# EasyEDA Pro project DPOV1.epro, board PCB2
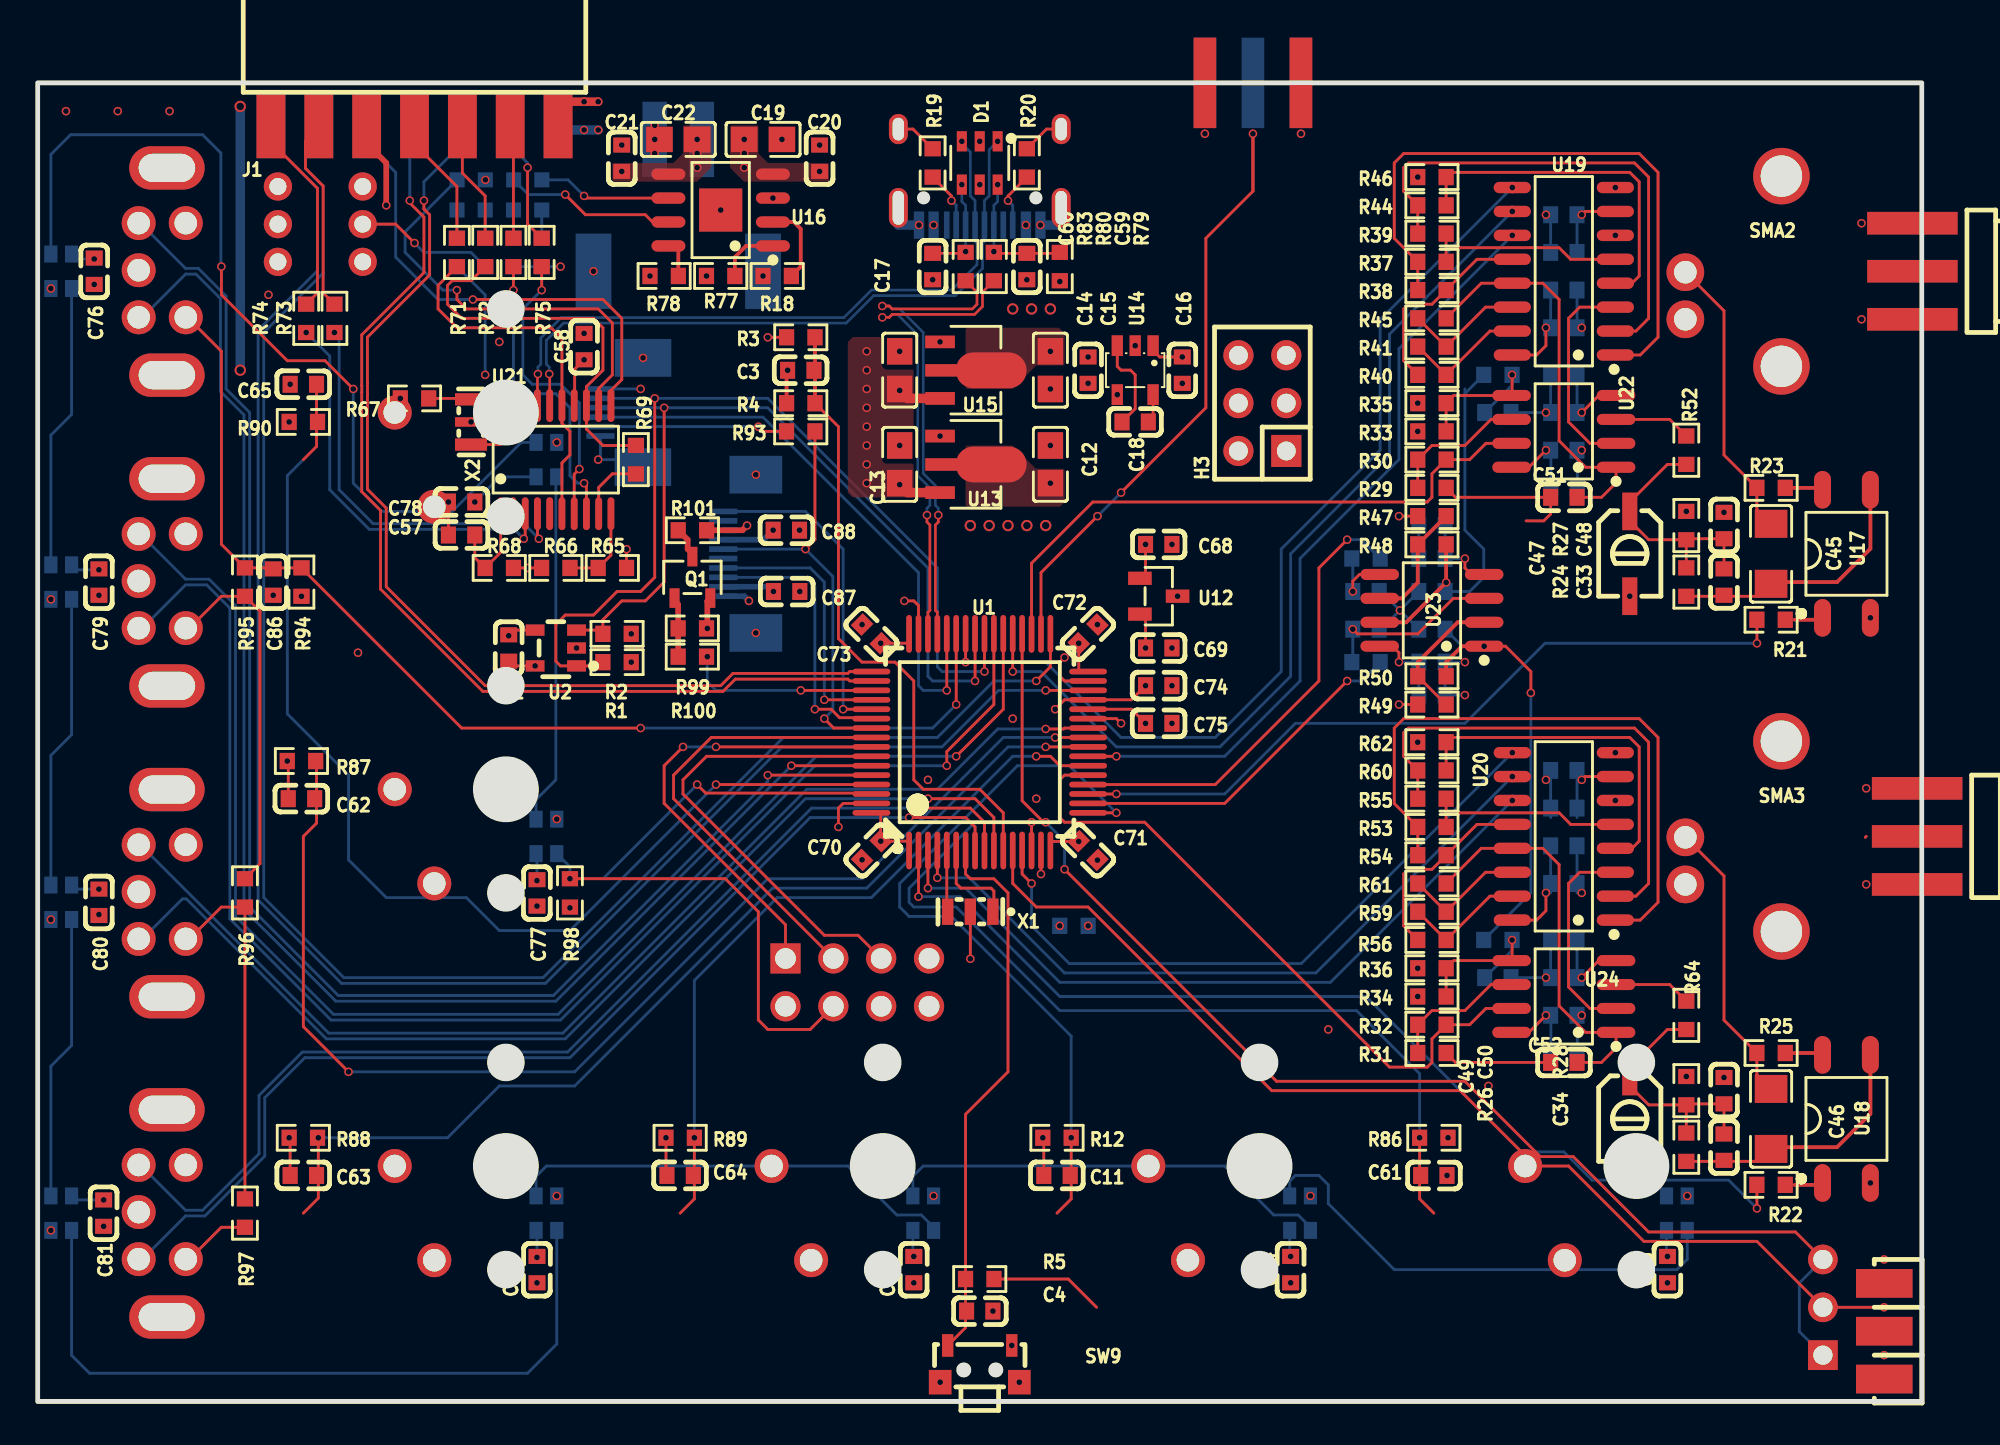
[diagram p4: board, top side]
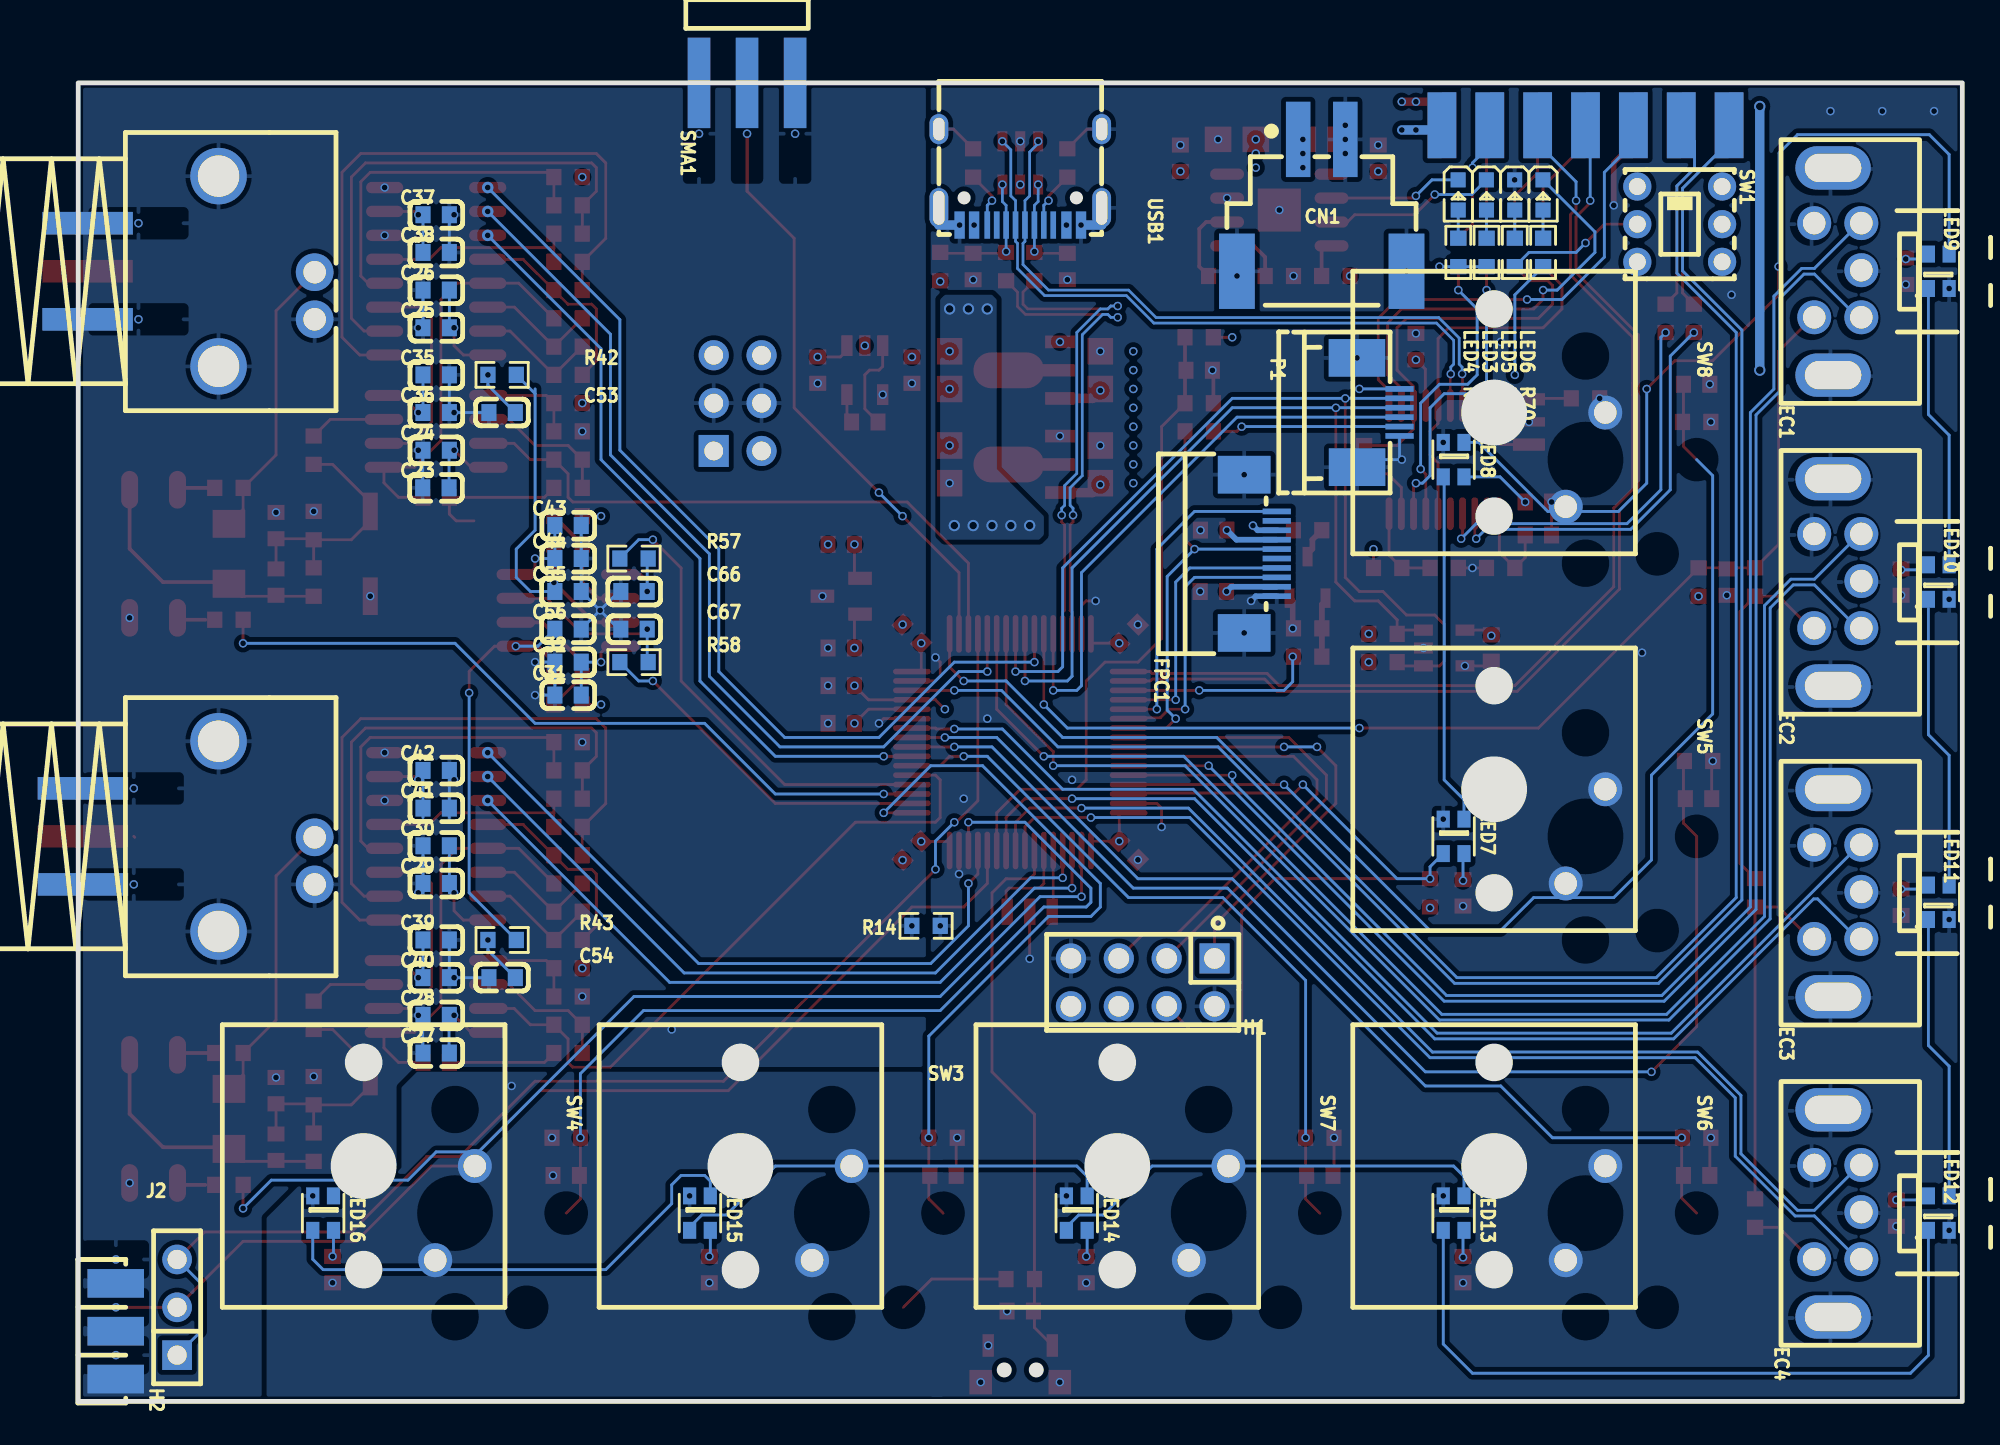
[diagram p5: board, bottom side, seen from below]

Outline 100 x 70 mm; copper layers: Top Layer, Inner1, 内层2, Bottom Layer. Coordinates in mm from the lower left corner of the outline.
Outline path: rectangle 100,0 0,70
Stack: Top Layer 0.035mm 外层铜厚1oz / Dielectric1 0.2104mm 7628 RC49% 8.6mil / Inner1 0.0152mm 内层铜厚 / Dielectric2 1.065mm 1.1mm H/HOZ Copper / 内层2 0.0152mm 内层铜厚 / Dielectric3 0.2104mm 7628 RC49% 8.6mil / Bottom Layer 0.035mm 外层铜厚1oz

## Design rules (mm)
net USB32P_P: DP2
net USB32P_N: DP2
net USB305_P: DP1
net USB305_N: DP1
net PA12: DP3
net PA11: DP3
net PA13: DP10
net PA14: DP10
net TX305: DP8
net PB10: DP9
net RX305: DP8
net PB11: DP9
net ENC4_1: DP5
net ENC4_2: DP5
net ENC3_1: DP4
net ENC3_2: DP4
net ENC20_2: DP6
net ENC20_1: DP6
net ENC1_2: DP7
net ENC1_1: DP7
template: 自定义配置
spacing copperThickness1oz (default): track to track 0.102, other pairs 0.152 to 0.3
spacing copperThickness2oz: track to track 0.203, other pairs 0.152 to 0.3
track width copperThickness1oz (default): min 0.127, default 0.15, max 2.54
track width copperThickness2oz: min 0.203, default 0.254, max 2.54
differential pair differentialPair (default): width min 0.1, default 0.15, max 0.2; gap min 0.152, default 0.152
differential pair 90ou: width min 0.127, default 0.141, max 0.254; gap min 0.15, default 0.15
via viaSize (default): diameter min 0.45, default 0.45, max 10; hole min 0.3, default 0.305, max 6.299
net VDD uses innerPlane2, 全连接
net VCC uses innerPlane2, 全连接
net VDDA uses 全连接
net VUSB uses innerPlane2, 全连接
net VBAT uses innerPlane2, 全连接
net USB32P_P uses 90ou
net USB32P_N uses 90ou
net USB305_P uses 90ou
net USB305_N uses 90ou
net PA12 uses 90ou
net PA11 uses 90ou
diff pair DP2 uses 90ou
diff pair DP1 uses 90ou
diff pair DP3 uses 90ou

## Placement (name value [footprint] x y rotation side)
C1  104  [C0603]  25 40 90 top
C3  104  [C0603]  40.5 54.74 0 top
C4  104  [C0603]  50 4.8 180 top
C11  104  [C0603]  54.1 12 0 top
C12  106  [C0805]  53.75 49.75 270 top
C13  106  [C0805]  45.75 49.75 90 top
C14  106  [C0805]  53.75 54.75 90 top
C15  105  [C0603]  55.75 54.75 90 top
C16  105  [C0603]  60.75 54.75 90 top
C17  106  [C0805]  45.75 54.75 90 top
C18  105  [C0603]  58.25 52 0 top
C19  10uF  [C0805]  38.5 67 180 top
C20  1uF  [C0603]  41.5 66 270 top
C21  1uF  [C0603]  31 66 270 top
C22  10uF  [C0805]  34 67 0 top
C23  104  [C0603]  81.02 48.51 0 bottom
C24  106  [C0603]  81 50.5 0 bottom
C25  104  [C0603]  81 57 0 bottom
C26  106  [C0603]  81 59 0 bottom
C27  104  [C0603]  81 18.5 0 bottom
C28  106  [C0603]  81 20.5 0 bottom
C29  104  [C0603]  81 27.5 0 bottom
C30  106  [C0603]  81 29.5 0 bottom
C31  104  [C0603]  74 37.5 0 bottom
C32  106  [C0603]  74 39.25 0 bottom
C33  100pF  [C0603]  89.5 43.5 270 top
C34  100pF  [C0603]  89.5 13.5 270 top
C35  104  [C0603]  81 54.5 0 bottom
C36  106  [C0603]  81 52.5 0 bottom
C37  104  [C0603]  81 63 0 bottom
C38  106  [C0603]  81 61 0 bottom
C39  104  [C0603]  81 24.5 0 bottom
C40  106  [C0603]  81 22.5 0 bottom
C41  104  [C0603]  81 31.5 0 bottom
C42  106  [C0603]  81 33.5 0 bottom
C43  104  [C0603]  74 46.5 0 bottom
C44  106  [C0603]  74 44.75 0 bottom
C45  100nF  [C1206]  92 45 270 top
C46  100nF  [C1206]  92 15 270 top
C47  30pF  [CAP-ADJ-SMD_L4.5-W3.2-L]  84.5 45 270 top
C48  300pF  [C0603]  89.5 46.5 270 top
C49  30pF  [CAP-ADJ-SMD_L4.5-W3.2-L]  84.5 15 270 top
C50  300pF  [C0603]  89.5 16.5 270 top
C51  104  [C0603]  81 48 180 top
C52  104  [C0603]  81 18 180 top
C53  104  [C0603]  77.5 52.5 180 bottom
C54  104  [C0603]  77.5 22.5 180 bottom
C55  104  [C0603]  74 43 180 bottom
C56  104  [C0603]  74 41 180 bottom
C57  100nF  [C0603]  22.5 46 0 top
C58  100nF  [C0603]  29 56 90 top
C59  22p  [C0603]  52.5 60.25 90 top
C60  22p  [C0603]  47.5 60.25 90 top
C61  104  [C0603]  74.1 12 180 top
C62  104  [C0603]  14 32 0 top
C63  104  [C0603]  14.1 12 0 top
C64  104  [C0603]  34.1 12 0 top
C65  104  [C0603]  14.1 54 0 top
C66  104  [C0603]  70.5 43 0 bottom
C67  104  [C0603]  70.5 41 0 bottom
C68  104  [C0603]  59.5 45.5 180 top
C69  104  [C0603]  59.5 40 0 top
C70  104  [C0603]  44.25 29.25 225 top
C71  104  [C0603]  55.75 29.25 315 top
C72  104  [C0603]  55.75 40.75 45 top
C73  104  [C0603]  44.25 40.75 135 top
C74  104  [C0603]  59.5 38 0 top
C75  104  [C0603]  59.5 36 0 top
C76  104  [C0603]  3 60 90 top
C77  104  [C0603]  26.5 27 90 top
C78  104  [C0603]  22.5 47.75 0 top
C79  104  [C0603]  3.25 43.5 90 top
C80  104  [C0603]  3.25 26.5 90 top
C81  104  [C0603]  3.5 10 90 top
C82  104  [C0603]  26.5 7 90 top
C83  104  [C0603]  46.5 7 90 top
C84  104  [C0603]  66.5 7 90 top
C85  104  [C0603]  86.5 7 90 top
C86  104  [C0603]  12.5 43.5 90 top
C87  104  [C0603]  39.75 43 180 top
C88  104  [C0603]  39.73 46.26 180 top
CN1  XH2.54-2P  [CONN-SMD_2P-P2.50-WT]  34 63.5 180 bottom
D1  SRV05-4  [SOT-23-6_L2.9-W1.6-P0.95-LS2.8-BL]  50 65.75 180 top
EC1  -  [ec11卧式立式编码器]  5.5 60 90 bottom
EC2  -  [ec11卧式立式编码器]  5.5 43.5 90 bottom
EC3  -  [ec11卧式立式编码器]  5.5 27 90 bottom
EC4  -  [ec11卧式立式编码器]  5.5 10 90 bottom
FPC1  AFC07-S10FCC-00  [FPC-SMD_P0.5-10P_LSXJ-H2.0-10P]  37.25 45 90 bottom
H1  -  [HDR-TH_8P-P2.54-V-F-R2-C4-S2.54-1]  43.5 22.25 0 bottom
H2  -  [HDR-TH_3P-P2.54-V-F]  94.75 5 90 bottom
H3  -  [HDR-TH_6P-P2.54-V-F-R2-C3-S2.54]  65 53 90 top
J1  2.54-2*7P母  [排母_2X7P_2.54_双层]  20 69.5 0 top
J2  -  [侧插排针_3Px2_2.54]  98 5 0 bottom
LED3  -  [LED_0603]  25.25 64 270 bottom
LED4  -  [LED_0603]  26.75 64 270 bottom
LED5  -  [LED_0603]  23.75 64 270 bottom
LED6  -  [LED_0603]  22.25 64 270 bottom
LED7  WS2812C-2020-V1  [LED-SMD_4P-L2.0-W2.0-TL_WS2812B-2020]  27 30 270 bottom
LED8  WS2812C-2020-V1  [LED-SMD_4P-L2.0-W2.0-TL_WS2812B-2020]  27 50 270 bottom
LED9  WS2812C-2020-V1  [LED-SMD_4P-L2.0-W2.0-TL_WS2812B-2020]  1.25 60 90 bottom
LED10  WS2812C-2020-V1  [LED-SMD_4P-L2.0-W2.0-TL_WS2812B-2020]  1.25 43.5 90 bottom
LED11  WS2812C-2020-V1  [LED-SMD_4P-L2.0-W2.0-TL_WS2812B-2020]  1.25 26.5 90 bottom
LED12  WS2812C-2020-V1  [LED-SMD_4P-L2.0-W2.0-TL_WS2812B-2020]  1.25 10 90 bottom
LED13  WS2812C-2020-V1  [LED-SMD_4P-L2.0-W2.0-TL_WS2812B-2020]  27 10 270 bottom
LED14  WS2812C-2020-V1  [LED-SMD_4P-L2.0-W2.0-TL_WS2812B-2020]  47 10 270 bottom
LED15  WS2812C-2020-V1  [LED-SMD_4P-L2.0-W2.0-TL_WS2812B-2020]  67 10 270 bottom
LED16  WS2812C-2020-V1  [LED-SMD_4P-L2.0-W2.0-TL_WS2812B-2020]  87 10 270 bottom
P1  AFC07-S06ECC-00  [FPC-SMD_AFC07-S06ECC-00]  31 52.5 270 bottom
Q1  SI2301CDS-T1-GE3_JC  [SOT-23-3_L3.0-W1.7-P0.95-LS2.9-BR]  34.75 43.75 270 top
R1  10K  [R0603]  30.75 39.25 0 top
R2  10K  [R0603]  30.75 40.75 0 top
R3  10K  [R0603]  40.5 56.49 180 top
R4  10K  [R0603]  40.5 52.99 0 top
R5  10K  [R0603]  50 6.5 0 top
R12  10K  [R0603]  54.1 14 0 top
R14  0  [R0603]  55 25.25 180 bottom
R17  10K  [R0603]  25.25 61 270 bottom
R18  1K  [R0603]  39.25 59.75 0 top
R19  5.1K  [R0603]  47.5 65.75 90 top
R20  5.1K  [R0603]  52.5 65.75 90 top
R21  1kΩ  [R0603]  92 41.5 180 top
R22  1kΩ  [R0603]  92 11.5 180 top
R23  50Ω  [R0603]  92 48.5 0 top
R24  820kΩ  [R0603]  87.5 43.5 270 top
R25  50Ω  [R0603]  92 18.5 0 top
R26  820kΩ  [R0603]  87.5 13.5 270 top
R27  205kΩ  [R0603]  87.5 46.5 270 top
R28  205kΩ  [R0603]  87.5 16.5 270 top
R29  10K  [R0603]  74 48.5 0 top
R30  10K  [R0603]  74 50 180 top
R31  10K  [R0603]  74 18.5 0 top
R32  10K  [R0603]  74 20 180 top
R33  30K(optional)  [R0603]  74 51.5 180 top
R34  30K(optional)  [R0603]  74 21.5 180 top
R35  10K(optional)  [R0603]  74 53 0 top
R36  10K(optional)  [R0603]  74 23 0 top
R37  200Ω  [R0603]  74 60.5 180 top
R38  402Ω  [R0603]  74 59 0 top
R39  100Ω  [R0603]  74 62 180 top
R40  806Ω  [R0603]  74 54.5 180 top
R41  1.62kΩ  [R0603]  74 56 180 top
R42  10K(optional)  [R0603]  77.5 54.5 0 bottom
R43  10K(optional)  [R0603]  77.5 24.5 0 bottom
R44  49.9Ω  [R0603]  74 63.5 0 top
R45  3.24kΩ  [R0603]  74 57.5 0 top
R46  49.9Ω  [R0603]  74 65 0 top
R47  500  [R0603]  74 47 180 top
R48  500  [R0603]  74 45.5 180 top
R49  500  [R0603]  74 37 180 top
R50  500  [R0603]  74 38.5 180 top
R52  1K  [R0603]  87.5 50.5 90 top
R53  200Ω  [R0603]  74 30.5 180 top
R54  402Ω  [R0603]  74 29 0 top
R55  100Ω  [R0603]  74 32 180 top
R56  806Ω  [R0603]  74 24.5 180 top
R57  1K  [R0603]  70.5 44.75 180 bottom
R58  1K  [R0603]  70.5 39.25 180 bottom
R59  1.62kΩ  [R0603]  74 26 180 top
R60  49.9Ω  [R0603]  74 33.5 0 top
R61  3.24kΩ  [R0603]  74 27.5 0 top
R62  49.9Ω  [R0603]  74 35 0 top
R64  1K  [R0603]  87.5 20.5 90 top
R65  10kΩ  [R0603]  30.5 44.25 0 top
R66  0Ω(NC)  [R0603]  27.5 44.25 0 top
R67  0Ω(NC)  [R0603]  20 53.25 0 top
R68  0Ω(NC)  [R0603]  24.5 44.25 180 top
R69  1kΩ  [R0603]  31.75 50 270 top
R70  10kΩ  [R0603]  22.25 61 90 bottom
R71  100Ω  [R0603]  22.25 61 90 top
R72  100Ω  [R0603]  23.75 61 90 top
R73  270Ω  [R0603]  15.75 57.5 90 top
R74  270Ω  [R0603]  14.25 57.5 90 top
R75  100Ω  [R0603]  26.75 61 90 top
R76  100Ω  [R0603]  25.25 61 90 top
R77  NC  [R0603]  36.25 59.75 0 top
R78  NC  [R0603]  33.25 59.75 180 top
R79  5.1K  [R0603]  54.25 60.25 90 top
R80  33R  [R0603]  50.75 60.25 270 top
R83  33R  [R0603]  49.25 60.25 270 top
R86  10K  [R0603]  74.1 14 180 top
R87  10K  [R0603]  14 34 0 top
R88  10K  [R0603]  14.1 14 0 top
R89  10K  [R0603]  34.1 14 0 top
R90  10K  [R0603]  14.1 52 0 top
R91  10K  [R0603]  23.75 61 90 bottom
R92  10K  [R0603]  26.75 61 270 bottom
R93  0  [R0603]  40.5 51.5 0 top
R94  10K  [R0603]  14 43.5 270 top
R95  10K  [R0603]  11 43.5 90 top
R96  10K  [R0603]  11 27 90 top
R97  10K  [R0603]  11 10 90 top
R98  10K  [R0603]  28.25 27 90 top
R99  10K  [R0603]  34.75 41.04 180 top
R100  10  [R0603]  34.75 39.54 0 top
R101  10  [R0603]  34.75 46.25 180 top
RF1  DOSIN-801-0031  [BNC-TH_DOSIN-801-0030]  90 60 90 bottom
RF2  DOSIN-801-0031  [BNC-TH_DOSIN-801-0030]  90 30 90 bottom
SMA1  SMA  [SMA-SMD_BWSMA-KE-P001]  64.5 70 90 bottom
SMA2  SMA  [SMA-SMD_BWSMA-KE-P001]  99.5 60 0 top
SMA3  SMA  [SMA-SMD_BWSMA-KE-P001]  99.75 30 0 top
SW1  PS-5850DVB-6PL  [SW-TH_6P-L5.8-W5.8-P2.00-LS4.5-BL_1]  15 62.5 270 bottom
SW3  CPG135001D02  [KEY-TH_CPG135001D0X]  60 10 270 bottom
SW4  CPG135001D02  [KEY-TH_CPG135001D0X]  80 10 270 bottom
SW5  CPG135001D02  [KEY-TH_CPG135001D0X]  20 30 270 bottom
SW6  CPG135001D02  [KEY-TH_CPG135001D0X]  20 10 270 bottom
SW7  CPG135001D02  [KEY-TH_CPG135001D0X]  40 10 270 bottom
SW8  CPG135001D02  [KEY-TH_CPG135001D0X]  20 50 270 bottom
SW9  TS-1010-C-A  [KEY-SMD_TX-1010-X-X]  50 2 180 top
U1  STM32G474RET6  [LQFP-64_L10.0-W10.0-P0.50-LS12.0-BL]  50 35 0 top
U2  AT24C02CM5/TR  [SOT-23-5_L2.9-W1.6-P0.95-LS2.8-BR]  27.5 40 0 top
U12  REF3030AIDBZRG4  [SOT-23-3_L2.9-W1.3-P1.90-LS2.4-BR]  59.5 42.75 180 top
U13  AMS1117-3.3  [SOT-89_L4.5-W2.5-P1.50-LS4.2-BR]  49.25 49.75 180 top
U14  TPS60403DBVR  [SOT-23-5_L3.0-W1.7-P0.95-LS2.8-BR]  58.25 54.75 90 top
U15  AMS1117-3.3  [SOT-89_L4.5-W2.5-P1.50-LS4.2-BR]  49.25 54.75 180 top
U16  TC4056A  [SOP-8_L4.9-W3.9-P1.27-LS6.0-BL-EP]  36.25 63.25 90 top
U17  GAQY212GSX  [SOP-4_L4.3-W4.4-P2.54-LS6.8-TR]  96 45 180 top
U18  GAQY212GSX  [SOP-4_L4.3-W4.4-P2.54-LS6.8-TR]  96 15 180 top
U19  CD4051BM96  [SOIC-16_L9.9-W3.9-P1.27-LS6.0-BL]  81 60 90 top
U20  CD4051BM96  [SOIC-16_L9.9-W3.9-P1.27-LS6.0-BL]  81 30 90 top
U21  -  [TSSOP-20_L6.5-W4.4-P0.65-LS6.4-BL]  27.5 50 0 top
U22  RS8752XK  [SOIC-8_L4.9-W3.9-P1.27-LS6.0-BL]  81 51.5 90 top
U23  RS8752XK  [SOIC-8_L4.9-W3.9-P1.27-LS6.0-BL]  74 42 90 top
U24  RS8752XK  [SOIC-8_L4.9-W3.9-P1.27-LS6.0-BL]  81 21.5 90 top
USB1  TYPEC-304-BCP16  [USB-C-SMD_TYPEC-304-BCP16]  50 65 0 bottom
X1  8MHz  [OSC-SMD_3P-L3.2-W1.3-P1.20-L]  49.5 26 180 top
X2  12MHz  [OSC-SMD_3P-L3.2-W1.3-P1.2-L]  23 52 90 top

## Footprints (pads in the part's own frame, mm; a bottom-side part is the same pattern mirrored in y, then rotated)
BNC-TH_DOSIN-801-0030
  round 2 hole 1.2: 1(-0.05,-2.55) 2(-2.55,-2.55)
  round 3 hole 2.2: 3(-5.05,2.55) 4(5.05,2.55)
C0603
  rect 0.8x0.9 smd: 1(-0.7,0) 2(0.7,0)
C0805
  rect 1.41x1.35 smd: 1(-1,0) 2(1,0)
C1206
  rect 1.485x1.728 smd: 1(-1.593,0) 2(1.593,0)
CAP-ADJ-SMD_L4.5-W3.2-L
  rect 1.999x0.8 smd: 1(-2.251,0) 2(2.251,0)
CONN-SMD_2P-P2.50-WT
  rect 1.3x4 smd: 1(-1.25,3.5) 2(1.25,3.5)
  rect 1.9x4 smd: 3(4.5,-3.5) 4(-4.5,-3.5)
ec11卧式立式编码器
  oval 2.3x4 hole 1.5x3: 6(5.486,1.36) 7(-5.514,1.36)
  round 1.8 hole 1.2: A(-2.444,-0.14) B(2.556,-0.14) C(0.056,-0.14) D(-2.444,2.36) E(2.556,2.36)
FPC-SMD_AFC07-S06ECC-00
  rect 0.3x1.5 smd: 1(1.245,1.131) 2(0.746,1.131) 3(0.245,1.131) 4(-0.255,1.131) 5(-0.754,1.131) 6(-1.254,1.131)
  rect 2x3 smd: 7(-2.901,-1.131) 8(2.901,-1.124)
FPC-SMD_P0.5-10P_LSXJ-H2.0-10P
  rect 0.3x1.5 smd: 1(-2.25,-0.865) 2(-1.75,-0.865) 3(-1.25,-0.865) 4(-0.75,-0.865) 5(-0.25,-0.865) 6(0.25,-0.865) 7(0.75,-0.865) 8(1.25,-0.865) 9(1.75,-0.865) 10(2.25,-0.865)
  rect 2x2.8 smd: 11(-4.2,0.865) 12(4.2,0.865)
HDR-TH_3P-P2.54-V-F
  rect 1.575x1.575 hole 1.02: 1(-2.54,0)
  round 1.575 hole 1.02: 2(0,0) 3(2.54,0)
HDR-TH_6P-P2.54-V-F-R2-C3-S2.54
  rect 1.7x1.6 hole 1: 1(-2.54,-1.27)
  round 1.6 hole 1: 2(-2.54,1.27) 3(0,-1.27) 4(0,1.27) 5(2.54,-1.27) 6(2.54,1.27)
HDR-TH_8P-P2.54-V-F-R2-C4-S2.54-1
  rect 1.6x1.6 hole 1.1: 1(-3.81,-1.27)
  round 1.6 hole 1.1: 2(-3.81,1.27) 3(-1.27,-1.27) 4(-1.27,1.27) 5(1.27,-1.27) 6(1.27,1.27) 7(3.81,-1.27) 8(3.81,1.27)
KEY-SMD_TX-1010-X-X
  rect 0.6x1.2 smd: 1(-1.7,-0.975) 2(1.7,-0.975)
  rect 1.2x1.3 smd: 3(-2.1,0.975) 4(2.1,0.975)
KEY-TH_CPG135001D0X
  round 1.8 hole 1.2: 1(-2.5,1.05) 2(2.5,-1.05)
LED-SMD_4P-L2.0-W2.0-TL_WS2812B-2020
  rect 0.9x0.7 smd: 1(-0.915,0.55) 2(-0.915,-0.55) 3(0.915,-0.55) 4(0.915,0.55)
LED_0603
  rect 0.8x0.8 smd: 1(-0.851,-0.01) 2(0.75,-0.005)
LQFP-64_L10.0-W10.0-P0.50-LS12.0-BL
  oval 0.3x2 smd: 1(-3.75,-5.75) 2(-3.25,-5.75) 3(-2.75,-5.75) 4(-2.25,-5.75) 5(-1.75,-5.75) 6(-1.25,-5.75) 7(-0.75,-5.75) 8(-0.25,-5.75) 9(0.25,-5.75) 10(0.75,-5.75) 11(1.25,-5.75) 12(1.75,-5.75) 13(2.25,-5.75) 14(2.75,-5.75) 15(3.25,-5.75) 16(3.75,-5.75) 33(3.75,5.75) 34(3.25,5.75) 35(2.75,5.75) 36(2.25,5.75) 37(1.75,5.75) 38(1.25,5.75) 39(0.75,5.75) 40(0.25,5.75) 41(-0.25,5.75) 42(-0.75,5.75) 43(-1.25,5.75) 44(-1.75,5.75) 45(-2.25,5.75) 46(-2.75,5.75) 47(-3.25,5.75) 48(-3.75,5.75)
  oval 2x0.3 smd: 17(5.75,-3.75) 18(5.75,-3.25) 19(5.75,-2.75) 20(5.75,-2.25) 21(5.75,-1.75) 22(5.75,-1.25) 23(5.75,-0.75) 24(5.75,-0.25) 25(5.75,0.25) 26(5.75,0.75) 27(5.75,1.25) 28(5.75,1.75) 29(5.75,2.25) 30(5.75,2.75) 31(5.75,3.25) 32(5.75,3.75) 49(-5.75,3.75) 50(-5.75,3.25) 51(-5.75,2.75) 52(-5.75,2.25) 53(-5.75,1.75) 54(-5.75,1.25) 55(-5.75,0.75) 56(-5.75,0.25) 57(-5.75,-0.25) 58(-5.75,-0.75) 59(-5.75,-1.25) 60(-5.75,-1.75) 61(-5.75,-2.25) 62(-5.75,-2.75) 63(-5.75,-3.25) 64(-5.75,-3.75)
OSC-SMD_3P-L3.2-W1.3-P1.2-L
  rect 0.65x1.7 smd: 1(-1.2,0) 3(1.2,0)
  rect 0.5x1.7 smd: 2(0,0)
OSC-SMD_3P-L3.2-W1.3-P1.20-L
  rect 0.6x1.4 smd: 1(-1.199,0) 2(0,0) 3(1.199,0)
R0603
  rect 0.806x0.864 smd: 1(-0.753,0) 2(0.753,0)
SMA-SMD_BWSMA-KE-P001
  rect 4.8x1.2 smd: 1(0,-2.55) 2(0,2.55) 5(0,0)
  rect 4.8x1.2 smd far side: 3(0,2.55) 4(0,-2.55)
SOIC-8_L4.9-W3.9-P1.27-LS6.0-BL
  oval 0.588x2.045 smd: 1(-1.905,-2.772) 2(-0.635,-2.772) 3(0.635,-2.772) 4(1.905,-2.772) 5(1.905,2.772) 6(0.635,2.772) 7(-0.635,2.772) 8(-1.905,2.772)
SOIC-16_L9.9-W3.9-P1.27-LS6.0-BL
  oval 0.602x1.971 smd: 1(-4.445,-2.736) 2(-3.175,-2.736) 3(-1.905,-2.736) 4(-0.635,-2.736) 5(0.635,-2.736) 6(1.905,-2.736) 7(3.175,-2.736) 8(4.445,-2.736) 9(4.445,2.736) 10(3.175,2.736) 11(1.905,2.736) 12(0.635,2.736) 13(-0.635,2.736) 14(-1.905,2.736) 15(-3.175,2.736) 16(-4.445,2.736)
SOP-4_L4.3-W4.4-P2.54-LS6.8-TR
  oval 0.9x2 smd: 1(1.27,3.4) 2(-1.27,3.4) 3(-1.27,-3.4) 4(1.27,-3.4)
SOP-8_L4.9-W3.9-P1.27-LS6.0-BL-EP
  oval 0.6x1.8 smd: 1(-1.905,-2.772) 2(-0.635,-2.772) 3(0.635,-2.772) 4(1.905,-2.772) 5(1.905,2.772) 6(0.635,2.772) 7(-0.635,2.772) 8(-1.905,2.772)
  rect 2.29x2.29 smd: 9(0,0)
SOT-23-3_L2.9-W1.3-P1.90-LS2.4-BR
  rect 1.25x0.7 smd: 1(1,-0.95) 2(1,0.95) 3(-1,0)
SOT-23-3_L3.0-W1.7-P0.95-LS2.9-BR
  rect 1.038x0.532 smd: 1(1.101,-0.95) 2(1.101,0.95) 3(-1.101,0)
SOT-23-5_L2.9-W1.6-P0.95-LS2.8-BR
  rect 1x0.6 smd: 1(1.1,-0.95) 2(1.1,0) 3(1.1,0.95) 4(-1.1,0.95) 5(-1.1,-0.95)
SOT-23-5_L3.0-W1.7-P0.95-LS2.8-BR
  rect 1.1x0.6 smd: 1(1.3,-0.95) 2(1.3,0) 3(1.3,0.95) 4(-1.3,0.95) 5(-1.3,-0.95)
SOT-23-6_L2.9-W1.6-P0.95-LS2.8-BL
  rect 0.532x1.072 smd: 1(-0.95,-1.149) 2(0,-1.149) 3(0.95,-1.149) 4(0.95,1.149) 5(0,1.149) 6(-0.95,1.149)
SOT-89_L4.5-W2.5-P1.50-LS4.2-BR
  rect 1.575x0.672 smd: 1(1.356,-1.5) 3(1.356,1.5)
  custom 5.377x1.9 smd: 2(-1.356,0.009)
SW-TH_6P-L5.8-W5.8-P2.00-LS4.5-BL_1
  round 1.5 hole 0.9: 1(-2,-2.25) 2(0,-2.25) 3(2,-2.25) 4(-2,2.25) 5(0,2.25) 6(2,2.25)
TSSOP-20_L6.5-W4.4-P0.65-LS6.4-BL
  oval 0.364x1.742 smd: 1(-2.925,-2.871) 2(-2.275,-2.871) 3(-1.625,-2.871) 4(-0.975,-2.871) 5(-0.325,-2.871) 6(0.325,-2.871) 7(0.975,-2.871) 8(1.625,-2.871) 9(2.275,-2.871) 10(2.925,-2.871) 11(2.925,2.871) 12(2.275,2.871) 13(1.625,2.871) 14(0.975,2.871) 15(0.325,2.871) 16(-0.325,2.871) 17(-0.975,2.871) 18(-1.625,2.871) 19(-2.275,2.871) 20(-2.925,2.871)
USB-C-SMD_TYPEC-304-BCP16
  oval 1x2.1 hole 0.6x1.8: 13(-4.32,1.633) 14(4.32,1.633)
  oval 1x1.6 hole 0.6x1.2: 15(-4.32,-2.547) 16(4.32,-2.547)
  rect 0.55x1.45 smd: A1B12(-3.225,2.547) A4B9(-2.45,2.547) B1A12(3.22,2.547) B4A9(2.45,2.547)
  rect 0.3x1.45 smd: A5(-1.25,2.547) A6(-0.25,2.547) A7(0.25,2.547) A8(1.25,2.547) B5(1.75,2.547) B6(0.75,2.547) B7(-0.75,2.547) B8(-1.75,2.547)
侧插排针_3Px2_2.54
  rect 3x1.52 smd: 1(0.007,3.81) 2(0.007,1.27) 3(0.007,-1.27)
  rect 3x1.52 smd far side: 4(0.007,-1.27) 5(0.007,1.27) 6(0.007,3.81)
排母_2X7P_2.54_双层
  custom 1.527x3.505 smd: 1(-7.62,-1.75) 2(-5.08,-1.75) 3(-2.54,-1.75) 4(0,-1.75) 5(2.54,-1.75) 6(5.08,-1.75) 7(7.62,-1.75)
  custom 1.527x3.505 smd far side: 8(7.62,-1.75) 9(5.08,-1.75) 10(2.54,-1.75) 11(0,-1.75) 12(-2.54,-1.75) 13(-5.08,-1.75) 14(-7.62,-1.75)

## Nets
As in the schematic.

Pads without a net: FPC1 9; LED16 1; SMA2 5; SMA3 5; U21 2 5; USB1 A8 B8

## Via types
v1: diameter 0.45, hole 0.305, Top Layer to Bottom Layer, 315 vias
v2: diameter 0.6, hole 0.4, Top Layer to Bottom Layer, 8 vias
v3: diameter 0.6, hole 0.405, Top Layer to Bottom Layer, 2 vias
v4: diameter 0.61, hole 0.305, Top Layer to Bottom Layer, 6 vias

## Routing (per net, layer and track width the routed paths; a pad name or vN(x,y) marks a point on that pad's centre or on a via; arc(x,y) is an arc through that point)
AGND:
  vias: v1(73.25,65)
GND: length 46.8
  Top Layer w0.15: C57.1 v1(21.8,47.75) ; v1(46,42.5) 46.5,42.5 46.75,42.25 U1.47 ; C11.1 53.4,13.95 v1(53.35,14) ; USB1.15 46.46,67.55 R19.2 ; 26.75,44.25 v1(26,44.25) R68.1 ; 33.4,11.9 33.35,11.95 v1(33.35,14) ; v1(42.5,30.5) 42.5,31.5 42.75,31.75 U1.63 ; U1.15 v1(53.25,28) ; USB1.16 53.54,67.55 R20.2 ; C62.1 13.3,33.95 v1(13.25,34) ; U1.31 54.5,38.25 54.25,38.5 54.25,39.25 v1(54.5,39.5) ; v1(13.35,14) 13.4,13.95 C63.1 ; 49.5,26.25 v1(49.5,23.5) ; C1.1 25.25,39.05 v1(26.4,39.05)
  Top Layer w0.2: R4.1 39.75,54.69 v1(39.8,54.74)
  Top Layer w0.3: v1(35.54,41.04) 35.54,42.49 Q1.2 ; J1.3 17.46,66.79 18.5,65.75 v1(18.5,63.5)
  Bottom Layer w0.15: P1.8 31.72,50 v1(29.75,50) 29.87,50.12 P1.1
  Bottom Layer w0.3: FPC1.1 37.5,42.75 v1(37.75,42.5)
  Bottom Layer w0.5: v1(53.22,62.45) 54.31,62.45 54.31,63.37 ; v1(46.78,62.45) 45.68,62.45 USB1.13
  vias: v1(0.7,59.08) v1(0.7,42.58) v1(0.7,25.58) v1(0.7,9.09) v1(1.5,68.5) v1(3,59.3) v1(3.25,42.8) v1(3.25,25.85) v1(3.5,9.3) v1(4.25,68.5) v1(7,68.5) v1(12.25,58.75) v1(12.5,42.8) v1(13.35,52) v1(13.4,54) v1(17,39.75) v1(19.25,53.25) v1(23,52) v1(23.76,64.85) v1(24.5,56.25) v1(25.88,52.87) v1(26.5,26.3) v1(26.5,6.3) v1(27.55,50.92) v1(27.55,30.92) v1(27.55,10.91) v1(28.6,40) v1(29,56.7) v1(29.5,60) v1(31,66.7) v1(32.13,55.4) v1(32.75,67.75) v1(32.75,67) v1(32.75,66.25) v1(35.5,59.75) v1(36.25,63.25) v1(38.12,49.2) v1(38.12,40.8) v1(38.5,59.75) v1(39.02,63.89) v1(39.5,67) v1(40.43,46.26) v1(40.45,43) v1(41.5,66.7) v1(43.75,41.25) v1(43.75,28.75) v1(45.75,55.75) v1(45.75,50.75) v1(46.5,6.3) v1(47.25,33) v1(47.5,59.55) v1(47.55,10.91) v1(47.89,51.25) v1(47.9,1.03) v1(50,66.9) v1(50.7,4.8) v1(51.7,2.97) v1(51.75,36.25) v1(52.1,1.03) v1(52.5,59.55) v1(53,32) v1(53.75,50.75) v1(54.25,25.25) v1(56.25,41.25) v1(56.25,28.74) v1(60.2,45.5) v1(66.5,6.3) v1(67.55,10.91) v1(74.8,12) v1(74.85,14) v1(77,16.75) v1(86.5,6.3) v1(87.55,10.91)
GNDA: length 35.3
  Top Layer w0.15: v1(57.5,36) 57.25,36.25 U1.27
  Bottom Layer w0.15: C35.1 C36.1 v1(80.05,52.5) C53.1 ; 81.72,18.51 81.72,20.48 C28.2 ; v1(72.3,42) 71.3,43 C66.2 ; v1(72.3,42) 71.3,41 C67.2 ; v1(72.3,42) C55.2 C44.1 C43.1 ; v1(72.3,42) C56.2 ; 81.7,29 C29.2 81.7,27 ; 80.3,33 C41.1 80.3,31 ; C26.2 C25.2 ; v1(75.75,39.25) C32.2 C31.2 v1(75.75,37.5) ; C39.1 C40.1 v1(80.05,22.5) C54.1 ; C37.1 C38.1 ; C23.2 81.72,50.48 C24.2
  vias: v1(47.89,56.25) v1(53.75,53.75) v1(55.75,54.05) v1(55.75,25.25) v1(57.3,53.45) v1(60.2,40) v1(60.2,38) v1(60.2,36) v1(60.5,42.75) v1(60.75,54.05) v1(61.95,67.3) v1(67.05,67.3) v1(68.5,19.75) v1(73.25,51.5) v1(73.25,35) v1(73.25,21.5) v1(80.05,63) v1(80.05,33) v1(81.95,57) v1(81.95,50.5) v1(81.95,27) v1(81.95,20.5) v1(83.74,64.44) v1(83.74,61.91) v1(83.74,34.44) v1(83.74,31.91) v1(84.5,42.75) v1(84.5,12.75) v1(87.5,47.25) v1(87.5,17.25) v1(89.5,47.2) v1(89.5,17.2) v1(96.8,62.55) v1(96.8,57.45) v1(97.05,32.55) v1(97.05,27.45) v1(97.27,41.6) v1(97.27,11.6) v1(98,7.54) v1(98,2.46)
VBAT:
  vias: v1(31,65.3) v1(35,67) v1(35,66.25) v1(35,65.5)
VCC: length 32.1
  Top Layer w0.15: R3.2 v1(38.75,56.49) ; v1(58.8,45.5) 58.8,44 U12.1 ; v1(20,61.5) 19,62.5 SW1.2
  Top Layer w0.5: U15.3 46.17,53.25 v1(45.75,53.67) ; v1(45.75,48.67) 46.17,48.25 U13.3
  Bottom Layer w0.15: LED7.4 26.5,29.03 v1(26.5,27.65) ; LED12.4 2.02,10.7 v1(3.5,10.7) ; v1(26.5,7.65) 26.5,9.03 LED13.4 ; LED14.4 46.45,7.75 v1(46.5,7.7) ; v1(3,60.65) 2.06,60.65 LED9.4 ; v1(23.2,47.75) 24.53,49.08 LED8.4 ; LED15.4 66.45,7.75 v1(66.5,7.7) ; LED10.4 2.06,44.15 v1(3.25,44.15) ; LED16.4 86.45,7.75 v1(86.5,7.7) ; v1(20,61.5) 20.5,61 23,61 R91.1 ; LED11.4 2.02,27.2 v1(3.25,27.2)
  vias: v1(28.25,26.2) v1(44,55.75) v1(44,54.75) v1(44,53.75) v1(44,52.75) v1(44,51.75) v1(44,50.75) v1(44,49.75) v1(44,48.75)
VDD: length 51.6
  Top Layer w0.15: U1.16 53.75,29.73 v1(55.26,29.73) ; U1.48 46.25,40.25 v1(44.75,40.25) ; R65.2 v1(31.25,45.25) ; R5.2 54.7,6.5 56.2,5 ; U21.14 28.5,52.9 28.5,54.8 v1(29,55.3) ; U1.64 44.75,31.25 v1(44.75,29.75) 46.25,29.75 U1.1 ; U1.32 55.25,38.75 v1(55.25,40.25) ; C1.2 25.25,40.95 U2.4
  Bottom Layer w0.15: R70.1 23.75,58.75 v1(23.75,54.5) ; P1.6 v1(32,53.75)
  Bottom Layer w0.3: FPC1.2 38.8,43.25 v1(39.05,43) ; v1(39.03,46.26) 38.53,45.75 FPC1.7
  Bottom Layer w0.5: J1.8 27.87,67.5 v1(29,67.5) v1(29.75,67.5) ; v3(10.75,54.75) v3(10.75,68.75)
  vias: v1(14,42.75) v1(25,40.65) v1(31.5,40.75) v1(31.5,39.25) v1(53.75,48.75) v1(54.25,59.45) v2(49.5,46.5) v2(50.5,46.5) v2(51.5,46.5) v2(51.75,58) v2(52.5,46.5) v2(52.75,58) v2(53.5,46.5) v2(53.75,58)
VDDA: length 28.1
  Top Layer w0.15: v1(72.25,39.25) 72.25,39.75 71.91,40.09 U23.8 ; v1(80.05,57) 80.05,56.05 79.56,55.56 U19.16 ; U22.8 79.15,49.59 v1(80.05,50.5) ; U24.8 79.15,19.59 v1(80.05,20.5) ; v1(80.05,27) 80.05,26.05 79.56,25.56 U20.16 ; v1(54,36.75) 54.5,37.25 U1.29 58.05,37.25 v1(58.8,38)
  Bottom Layer w0.15: 80.3,29 C29.1 80.3,27 ; C28.1 80.32,20.48 80.32,18.51 ; C24.1 80.32,50.48 C23.1 ; C25.1 C26.1 ; C31.1 C32.1 v1(72.25,39.25)
  vias: v1(53.75,55.75) v1(55.75,55.45) v1(58.25,56.05)
VEEA: length 22.5
  Top Layer w0.15: 76.77,43.9 76.09,43.9 75.75,44.25 v1(75.75,44.75) ; v1(60.75,55.45) 59.55,55.45 59.2,55.8 U14.1 ; U22.4 82.85,53.41 v1(81.95,52.5) ; v1(81.95,22.5) 82.85,23.41 U24.4 ; v1(81.95,33) 82.12,33.17 U20.7 ; U19.7 82.12,63.17 v1(81.95,63)
  Bottom Layer w0.15: C38.2 C37.2 ; v1(75.75,44.75) 74.7,44.75 74.7,46.5 ; C35.2 C36.2 ; 81.7,33 C41.2 81.7,31 ; C39.2 C40.2
(no net): length 0.1
  Top Layer w0.15: 97.05,30 97,29.95
AC/DC_CH1: length 40.1
  Top Layer w0.15: v1(57.25,32.25) U1.19 ; R21.2 91.25,41.5 v1(91.25,40.25)
  Bottom Layer w0.15: v1(91.25,40.25) 80,40.25 75.75,36 66.75,36 63,32.25 v1(57.25,32.25)
AC/DC_CH2: length 55.1
  Top Layer w0.15: R22.2 91.25,11.5 v1(91.25,10.25) ; U1.2 v1(46.75,26.8)
  Bottom Layer w0.15: v1(46.75,26.8) 48.95,26.8 54.25,21.5 70.5,21.5 78.75,13.25 81,13.25 82.5,11.75 89.75,11.75 v1(91.25,10.25)
BOOT0: length 59.8
  Top Layer w0.15: 14.1,50 14.8,50.7 C65.2 ; U1.61 v1(36,32.75)
  Bottom Layer w0.15: 14.1,50 13.25,49.15 13.25,36.5 16.5,33.25 16.5,28.75 18.5,26.75 22.75,26.75 24.5,25 28.25,25 v1(36,32.75)
BUTTON0: length 53.8
  Top Layer w0.15: 14.1,10 14.89,10.79 v1(14.89,14) ; v1(53.5,34.75) U1.24
  Bottom Layer w0.15: v1(14.89,14) 21.75,14 24.5,16.75 28.5,16.75 39,27.25 44,27.25 51.5,34.75 v1(53.5,34.75)
BUTTON1: length 64.4
  Top Layer w0.15: 14.8,34 14.8,30.7 14.1,30 14.1,19.9 v1(16.5,17.5) ; v1(54,35.25) U1.25
  Bottom Layer w0.15: v1(54,35.25) 51.25,35.25 43.75,27.75 38.75,27.75 28.5,17.5 v1(16.5,17.5)
BUTTON2: length 48.8
  Top Layer w0.15: U1.14 v1(52.75,30.75) ; v1(73.35,14) 73.35,10.75 74.1,10
  Bottom Layer w0.15: v1(52.75,30.75) 49.75,30.75 46.25,27.25 46.25,26.5 46.5,26.25 48.75,26.25 54.25,20.75 70,20.75 73.35,17.4 v1(73.35,14)
BUTTON3: length 39.5
  Top Layer w0.15: 54.1,10 54.85,10.75 v1(54.85,14) ; v1(57.25,31.25) U1.17
  Bottom Layer w0.15: v1(57.25,31.25) 54.75,33.75 52,33.75 45.75,27.5 45.75,26.25 46.25,25.75 48.5,25.75 54.85,19.4 v1(54.85,14)
BUTTON4: length 38.7
  Top Layer w0.15: v1(53,34.25) 53.75,34.25 54.25,33.75 U1.22 ; v1(34.85,14) 34.85,10.75 34.1,10
  Bottom Layer w0.15: v1(53,34.25) 51.75,34.25 44.25,26.75 39.25,26.75 34.85,22.35 v1(34.85,14)
BUTTON_ADC: length 60
  Top Layer w0.15: v1(32,35.75) 22.5,35.75 14,44.25 R95.2 9.75,45.5 9.75,55.75 8,57.5 ; U1.43 v1(48.75,37)
  Bottom Layer w0.15: v1(32,35.75) 47.5,35.75 v1(48.75,37)
CD_CH1_A: length 41.2
  Top Layer w0.15: v1(57.25,34.25) U1.23
  Bottom Layer w0.15: v4(78.26,61.91) 72.25,55.89 72.25,50 67,44.75 67,38.25 63,34.25 v1(57.25,34.25)
CD_CH1_B: length 49.5
  Top Layer w0.15: v1(51.75,38.75) U1.37
  Bottom Layer w0.15: v1(51.75,38.75) 53.25,38.75 57.25,34.75 62.75,34.75 66.5,38.5 66.5,45 71.75,50.25 71.75,56.66 v4(78.26,63.17)
CD_CH1_C: length 52.1
  Top Layer w0.15: U1.42 v1(49.25,39.25)
  Bottom Layer w0.15: v1(49.25,39.25) 53.5,39.25 57.5,35.25 62.5,35.25 66,38.75 66,45.25 71.25,50.5 71.25,57.43 v4(78.26,64.44)
CD_CH1_N: length 11.2
  Top Layer w0.15: U19.3 81.84,58.09 81.25,57.5 81.25,52 82.38,50.86 U22.2
CD_CH1_OUT: length 21.4
  Top Layer w0.15: C51.1 83,48 83.77,48.77 U22.1 82.16,49.59 80.75,51 80.75,58.5 79.88,59.36 U19.13 76.62,59.36 R45.2
CD_CH2_A: length 39.1
  Top Layer w0.15: v1(47.25,27.25) U1.3
  Bottom Layer w0.15: v4(78.26,31.91) 68.61,22.25 54.25,22.25 49.25,27.25 v1(47.25,27.25)
CD_CH2_B: length 38.4
  Top Layer w0.15: U1.4 v1(47.75,27.8)
  Bottom Layer w0.15: v1(47.75,27.8) 49.45,27.8 54.5,22.75 67.84,22.75 v4(78.26,33.17)
CD_CH2_C: length 35.2
  Top Layer w0.15: U1.13 52.25,28 v1(52.75,27.5)
  Bottom Layer w0.15: v4(78.26,34.44) 67.07,23.25 54.75,23.25 52.75,25.25 v1(52.75,27.5)
CD_CH2_N: length 11.2
  Top Layer w0.15: U20.3 81.84,28.09 81.25,27.5 81.25,22 82.38,20.86 U24.2
CD_CH2_OUT: length 21.4
  Top Layer w0.15: C52.1 83,18 83.77,18.77 U24.1 82.16,19.59 80.75,21 80.75,28.5 79.88,29.36 U20.13 76.62,29.36 R61.2
D_RST_305: length 25.9
  Top Layer w0.15: U21.11 30.43,53.67 31,54.25 31,57.5 30,58.5 v1(23.1,58.5)
  Bottom Layer w0.15: J1.12 17.46,66.79 19,65.25 19,60.75 21.25,58.5 v1(23.1,58.5)
D_SWCLK_305: length 19.5
  Top Layer w0.15: 27.83,47.13 27.83,49.83 28.25,50.25 28.25,51.5 27.83,51.92 27.83,56.42 27.25,57 22.25,57 21.25,58 21.25,59.25 22.25,60.25 R71.1
D_SWDIO_305: length 20.9
  Top Layer w0.15: 31.75,50.75 30,50.75 29.12,51.62 U21.13 29.12,53.88 30,54.75 30,57 29.5,57.5 22.5,57.5 21.75,58.25 21.75,59.25 22,59.5 23,59.5 23.75,60.25 R72.1
DDS_ON_CHIP: length 34.3
  Top Layer w0.15: v1(56.25,47) 53.25,44 U1.34 ; v1(57.5,48.25) 62,52.75 62,61.75 64.5,64.25 ; 64.5,64.25 v1(64.5,67.3) 64.5,64.25
  Bottom Layer w0.15: v1(56.25,47) v1(57.5,48.25)
DPO_CH1: length 32.6
  Top Layer w0.15: U1.35 52.75,44.5 56,47.75 73.75,47.75 74,48 74,49.25 R30.1 76,50 76.87,50.86 U22.7
DPO_CH1_F: length 13.4
  Top Layer w0.15: R27.2 85.5,45.75 84.5,46.75 C47.1 84.5,47.75 86.5,49.75 R52.1 ; R27.2 R24.1 ; R27.2 87.55,45.8 C48.2 C33.1
DPO_CH2: length 35.1
  Top Layer w0.15: U1.21 54.5,33.25 54.25,33 54.25,31 54.5,30.75 58.75,30.75 71.75,17.75 73.75,17.75 74,18 74,19.25 R32.1 76,20 76.87,20.86 U24.7
DPO_CH2_F: length 13.4
  Top Layer w0.15: R26.1 R28.2 ; R28.2 85.5,15.75 84.5,16.75 C49.1 84.5,17.75 86.5,19.75 R64.1 ; R28.2 87.55,15.8 C50.2 C34.1
DPO_REF_P: length 68.4
  Top Layer w0.15: U1.36 52.25,31.89 53.39,30.75 v1(53.5,30.75) ; v1(54.5,28.25) 65.75,17 75.75,17 79.75,13 81.5,13 85.5,9 93.29,9 H2.3
  Bottom Layer w0.15: H2.3 93.5,6.29 93.5,3.71 H2.1 ; v1(53.5,30.75) 54.5,29.75 v1(54.5,28.25)
ENC1_1: length 79.2
  Top Layer w0.15: U1.59 v1(40,33.75)
  Bottom Layer w0.15: 5.5,57.5 7.85,59.85 8.4,59.85 9.7,58.55 9.7,53.62 10.95,52.38 10.95,26.12 15.82,21.25 27.5,21.25 v1(40,33.75)
ENC1_2: length 79
  Top Layer w0.15: U1.60 v1(38.75,33.25)
  Bottom Layer w0.15: 5.5,62.5 7.85,60.15 8.53,60.15 10,58.68 10,53.75 11.25,52.5 11.25,26.25 15.95,21.55 27.38,21.55 38.75,32.93 v1(38.75,33.25)
ENC3_1: length 57.3
  Top Layer w0.15: U1.8 49.75,30.5 49.25,31 v1(46.25,31)
  Bottom Layer w0.15: 5.5,7.5 7.85,9.85 8.88,9.85 12.05,13.03 12.05,16.12 14.18,18.25 28.25,18.25 41,31 v1(46.25,31)
ENC3_2: length 58.2
  Top Layer w0.15: U1.9 50.25,30.75 49.5,31.5 v1(46.75,31.5)
  Bottom Layer w0.15: 5.5,12.5 7.85,10.15 8.75,10.15 11.75,13.15 11.75,16.25 14.05,18.55 28.12,18.55 41.07,31.5 v1(46.75,31.5)
ENC4_1: length 56.7
  Top Layer w0.15: U1.10 50.75,31 49.75,32 v1(47.25,32)
  Bottom Layer w0.15: 5.5,24.5 7.68,26.68 7.89,26.68 15.32,19.25 28,19.25 40.75,32 v1(47.25,32)
ENC4_2: length 61.1
  Top Layer w0.15: v1(53.5,35.7) 54.45,35.7 54.5,35.75 U1.26
  Bottom Layer w0.15: 5.5,29.5 15.45,19.55 27.88,19.55 40.82,32.5 47.75,32.5 50.95,35.7 v1(53.5,35.7)
ENC20_1: length 76.6
  Top Layer w0.15: U1.39 50.75,37 48.25,34.5 v1(48.25,33.75)
  Bottom Layer w0.15: 5.5,41 7.85,43.35 8.97,43.35 10.2,42.12 10.2,25.62 15.57,20.25 27.75,20.25 41.25,33.75 v1(48.25,33.75)
ENC20_2: length 76.7
  Top Layer w0.15: U1.38 51.25,36.75 v1(48.75,34.25)
  Bottom Layer w0.15: 5.5,46 7.85,43.65 9.1,43.65 10.5,42.25 10.5,25.75 15.7,20.55 27.62,20.55 41.32,34.25 v1(48.75,34.25)
IAP_305: length 4.7
  Top Layer w0.15: U21.10 30.43,44.93 29.75,44.25 R66.2
IIC_SCL: length 51.9
  Top Layer w0.15: 30,39.25 29.8,39.05 U2.1 27.75,39.05 27.5,39.3 27.5,41.25 28,41.75 29.5,41.75 30.75,43 32,43 32.75,43.75 v1(32.75,53.25) ; U1.40 v1(50.25,38.75)
  Bottom Layer w0.15: P1.5 38.75,53.25 47.75,44.25 47.75,39 48,38.75 v1(50.25,38.75)
IIC_SDA: length 47.3
  Top Layer w0.15: U1.41 v1(49.75,38.25) ; v1(33.25,52.75) 33.25,43.5 32.25,42.5 31,42.5 30,41.5 30,40.75 29.8,40.95 U2.3
  Bottom Layer w0.15: P1.4 38.75,52.75 47.25,44.25 47.25,38.5 47.5,38.25 v1(49.75,38.25)
IN_CH1: length 15.3
  Top Layer w0.15: C45.1 91.25,47.35 R23.1 89.5,50.25 89.5,57.9 RF1.1 87.5,60
IN_CH2: length 15.2
  Top Layer w0.15: C46.1 91.25,17.35 R25.1 89.5,20.25 89.5,27.9 RF2.1
INT_FT: length 30.9
  Top Layer w0.15: U1.44 v1(48.25,37.75)
  Bottom Layer w0.15: v1(48.25,37.75) 47,37.75 46.75,38 46.75,44 38.5,52.25 P1.3
LAT: length 24.3
  Top Layer w0.15: H1.1 39.69,25.31 33.25,31.75 33.25,33.75 v1(34.25,34.75) ; v1(36,34.75) U1.57
  Bottom Layer w0.15: v1(34.25,34.75) v1(36,34.75)
LED_CON_305: length 22.5
  Top Layer w0.15: v1(22.25,59) 22.25,58.5 22.75,58 29.75,58 30.5,57.25 30.5,54.5 29.78,53.78 U21.12
  Bottom Layer w0.15: v1(22.25,59) 21.5,59 19.5,61 19.5,62.09 LED6.1
LEDK: length 3.6
  Top Layer w0.3: v1(37.65,46.5) 37.4,46.25 R101.1
  Bottom Layer w0.3: FPC1.8 37.4,46.25 v1(37.65,46.5)
MODES_305: length 4.2
  Top Layer w0.15: U21.20 24.58,53.17 24.55,53.2 X2.3 22.95,53.25 R67.2
NRST: length 29.3
  Top Layer w0.15: SW9.2 49.25,3.92 R5.1 49.25,15.25 51.5,17.5 51.5,27 50.75,27.75 49.5,27.75 49.25,28 U1.7
OFFSET_CH1: length 24.8
  Top Layer w0.15: U1.20 62.5,32.75 68,38.25 68,44.25 v1(69.5,45.75)
  Bottom Layer w0.15: R57.1 70.25,45.75 v1(69.5,45.75)
OFFSET_CH1_E: length 20.6
  Top Layer w0.2: U23.7 72.63,41.36 v1(74.75,43.48) R48.1
  Bottom Layer w0.15: 75.75,53.5 75.75,46.25 76.75,45.25 76.75,43.75 76,43 C55.1 ; 75.75,53.5 75.75,53.75 ; 75.75,53.5 R42.1
OFFSET_CH2: length 18.6
  Top Layer w0.15: U1.18 63,31.75 v1(69.5,38.25)
  Bottom Layer w0.15: R58.1 70.25,38.25 v1(69.5,38.25)
OFFSET_CH2_E: length 23.9
  Top Layer w0.15: v1(76.77,40.09) 77.91,40.09 79.25,38.75 v1(79.25,37.62)
  Top Layer w0.2: R50.1 74.75,39.25 75.59,40.09 v1(76.77,40.09)
  Bottom Layer w0.15: R43.1 79.25,27 v1(79.25,37.62) ; C56.1 75.6,40.09 v1(76.77,40.09)
OSC_IN_305: length 3.9
  Top Layer w0.15: U21.19 25.22,51.47 24.55,50.8 X2.1
PA0: length 57.3
  Top Layer w0.15: v1(98,5) H2.2 91.25,8.5 85.25,8.5 81.25,12.5 79.5,12.5 75.5,16.5 65.5,16.5 55.75,26.25 53,26.25 51.75,27.5 U1.12
PA11: length 25.9
  Top Layer w0.141: U1.45 47.75,41.89 47.65,42 47.65,46.53 47.8,46.69 v1(47.8,47.05) ; R83.2 49.85,58.89 49.85,58.25 49.6,58 45.35,58 45.19,58.16 v1(44.83,58.16)
  Bottom Layer w0.141: v1(44.83,58.16) 45.19,58.16 45.35,58 45.75,58 47,56.75 47,49.27 47.65,48.62 47.65,47.58 47.8,47.42 v1(47.8,47.05)
PA12: length 25.9
  Top Layer w0.141: U1.46 47.25,41.89 47.35,42 47.35,46.53 47.2,46.69 v1(47.2,47.05) ; v1(44.83,57.55) 45.19,57.55 45.35,57.71 49.72,57.71 50.15,58.13 50.15,58.89 R80.2
  Bottom Layer w0.141: v1(47.2,47.05) 47.2,47.42 47.35,47.58 47.35,48.5 46.71,49.15 46.71,56.63 45.63,57.71 45.35,57.71 45.19,57.55 v1(44.83,57.55)
PA13: length 55.5
  Top Layer w0.15: U1.49 43.1,38.75 43,38.65 36.9,38.65 36.25,38 23.75,38 18.5,43.25 18.5,47.43 17.5,48.43 17.5,53.43 17.5,53.44 17.5,54.06 17.5,54.07 17.5,56.5 20.8,59.8 20.8,63 20.5,63.3 v1(20.5,63.75)
  Bottom Layer w0.15: J1.10 22.54,66.79 20.5,64.75 v1(20.5,63.75)
PA14: length 55.4
  Top Layer w0.15: v1(19.75,63.75) 19.75,63.62 20.5,62.88 20.5,59.93 17.2,56.62 17.2,53.94 17.2,53.94 17.2,53.56 17.2,53.56 17.2,48.3 18.2,47.3 18.2,43.12 23.62,37.7 36.38,37.7 37.03,38.35 43,38.35 43.1,38.25 U1.50
  Bottom Layer w0.15: v1(19.75,63.75) 19.75,67.5 J1.11
PA15: length 10.2
  Top Layer w0.15: v1(40.5,37.75) U1.51
  Bottom Layer w0.15: v1(40.5,37.75) 36,37.75 35.54,38.21 v1(35.54,39.54)
PB3: length 24.6
  Top Layer w0.15: U1.56 35.75,35.25 33.75,33.25 33.75,32 H1.3
PB5: length 25.4
  Top Layer w0.15: U1.58 35.5,34.25 34.25,33 34.25,32.25 41.75,24.75 43.54,24.75 H1.5
PB9: length 41.1
  Top Layer w0.15: v1(35,32.75) 35.45,32.3 44.2,32.3 U1.62 ; v1(28.25,27.75) 36.5,27.75 38.25,26 38.25,20.25 38.75,19.75 41,19.75 H1.4
  Bottom Layer w0.15: v1(35,32.75) 30,27.75 v1(28.25,27.75) 28.25,28.39 LED7.3
PB10: length 95.8
  Top Layer w0.15: U1.30 v1(53.5,37.75) 53.47,37.75
  Bottom Layer w0.15: v1(53.5,37.75) 51,37.75 48,34.75 39.5,34.75 26.95,22.2 16.12,22.2 11.7,26.62 11.7,56.88 14.85,60.03 14.85,64.4 12.38,66.87 J1.14
PB11: length 95.1
  Top Layer w0.15: U1.33 53.75,39 v1(53,38.25)
  Bottom Layer w0.15: J1.13 14.92,67.62 14.21,66.92 14.21,65.46 15.15,64.53 15.15,59.9 12,56.75 12,26.75 16.25,22.5 26.82,22.5 39.57,35.25 47.75,35.25 50.75,38.25 v1(53,38.25)
PB14_305: length 15.8
  Top Layer w0.15: v1(28.75,49.5) 28.48,49.22 U21.7 ; R75.1 v1(26.75,59)
  Bottom Layer w0.15: v1(26.75,59) 25.75,58 25.75,54.5 26.25,54 27.75,54 28.75,53 v1(28.75,49.5)
PB15_305: length 16
  Top Layer w0.15: v1(29,48.75) 29.12,48.62 U21.8 ; R76.1 v1(25.25,59)
  Bottom Layer w0.15: v1(29,48.75) 28.65,48.75 28.25,49.15 28.25,52.75 27.5,53.5 25.75,53.5 25.25,54 v1(25.25,59)
PC3: length 34.2
  Top Layer w0.15: R4.2 42.5,51.75 42.5,40.5 43.75,39.25 45.5,39.25 46.5,38.25 46.5,33 47,32.5 50,32.5 51.25,31.25 U1.11
  Top Layer w0.2: R4.2 R3.1
PC6_305: length 3.7
  Top Layer w0.15: R69.2 30.5,49.25 29.78,48.53 U21.9
PC10: length 14.4
  Top Layer w0.15: U1.52 v1(41.75,37.25)
  Bottom Layer w0.15: v1(41.75,37.25) 41.75,43.5 41,44.25 FPC1.4
PC11: length 17.2
  Top Layer w0.15: U1.53 v1(42.75,36.75)
  Bottom Layer w0.15: v1(42.75,36.75) 42.75,45.25 40.75,47.25 FPC1.10
PC12: length 14.8
  Top Layer w0.15: v1(41.25,36.75) 42.11,36.75 42.56,36.3 44.2,36.3 U1.54
  Bottom Layer w0.15: v1(41.25,36.75) 41.25,43.25 40.75,43.75 FPC1.3
PD2: length 23.3
  Top Layer w0.15: v1(41.75,36.25) 42.25,35.75 U1.55 ; v1(40.75,45.25) 41.25,45.75 R93.2
  Bottom Layer w0.15: FPC1.6 v1(40.75,45.25) 42.2,43.8 42.2,36.7 v1(41.75,36.25)
RST_305: length 5.2
  Top Layer w0.15: U21.1 24.58,45.08 23.75,44.25 23.2,44.8 C57.2
RST_FT: length 10
  Top Layer w0.15: v1(38.25,51.75) 38.5,51.5 39.75,51.5
  Bottom Layer w0.15: 38.25,51.75 38.28,51.75 ; 38.25,51.75 P1.2 ; 38.25,51.75 v1(38.25,51.75)
RX305: length 10.4
  Top Layer w0.15: 15.75,58.25 15.15,58.85 15.15,64.53 14.21,65.46 14.21,66.92 14.92,67.62 J1.2
SWCLK/TCK305: length 6.9
  Top Layer w0.15: J1.4 20,66.75 22.25,64.5 22.25,61.75
SWDIO/TMS305: length 6.5
  Top Layer w0.15: J1.5 22.54,65.21 23.75,64 23.75,61.75
TDI305: length 6.1
  Top Layer w0.15: J1.6 25.25,67.58 25.25,61.75
TDO305: length 6.7
  Top Layer w0.15: 26.75,61.75 26,62.5 v1(26,65.5)
  Bottom Layer w0.15: J1.9 25.08,66.67 26,65.75 v1(26,65.5)
TX305: length 10.8
  Top Layer w0.15: 14.25,58.25 14.85,58.85 14.85,64.4 12.38,66.87 J1.1
UART3_RX_305: length 21.5
  Top Layer w0.15: v1(26.6,45.8) 26.53,45.88 U21.4
  Bottom Layer w0.15: v1(26.6,45.8) 25.8,46.6 17.8,46.6 16,48.4 16,56.5 v1(15.75,56.75)
UART3_TX_305: length 21.6
  Top Layer w0.15: v1(25.8,45.8) 25.88,45.88 U21.3
  Bottom Layer w0.15: v1(14.25,56.75) 15.5,55.5 15.5,48.4 17.6,46.3 25.3,46.3 v1(25.8,45.8)
USB32P_N: length 5.4
  Top Layer w0.141: C60.2 49.16,60.95 v1(49.25,61.05)
  Bottom Layer w0.141: v1(49.05,64.6) 49.05,63.7 49.25,63.5 USB1.B7 v1(49.25,61.05)
USB32P_P: length 7.2
  Top Layer w0.141: R80.1 50.8,60.95 C59.2 54.2,60.95 R79.2
  Bottom Layer w0.141: v1(50.95,64.6) 50.95,63.7 50.75,63.5 USB1.B6 v1(50.75,61.05)
USB305_N: length 35.4
  Top Layer w0.141: v1(27.15,54.55) 27.18,54.52 U21.16
  Bottom Layer w0.141: v1(27.15,54.55) 27.15,54.91 27,55.07 27,56.33 27.91,57.25 42.91,57.25 44.37,58.71 48.71,58.71 50.15,60.15 50.15,61.48 50.25,61.59 USB1.A7 50.25,63.75 50.5,64 50.5,66.45 v1(50.95,66.9)
USB305_P: length 35.3
  Top Layer w0.141: U21.17 26.53,54.52 v1(26.55,54.55)
  Bottom Layer w0.141: v1(49.05,66.9) 49.05,66.78 49.5,66.33 49.5,64 49.75,63.75 USB1.A6 49.75,61.59 49.85,61.48 49.85,60.35 48.5,59 44.25,59 42.79,57.54 27.79,57.54 26.7,56.45 26.7,55.07 26.55,54.91 v1(26.55,54.55)
VREF+: length 7.3
  Top Layer w0.15: R47.2 v1(72.25,47) ; U1.28 58.05,36.75 v1(58.8,36) ; U12.2 58.8,41.5 v1(58.8,40) ; R49.2 v1(72.25,37)
  vias: v1(73.25,53) v1(73.25,23)
VUSB: length 5.9
  Top Layer w0.45: v1(29.75,69) v1(29,69) 27.62,69 J1.7
  Bottom Layer w0.15: R17.2 R92.2 v1(27.75,60.25)
  vias: v1(32.5,59.75) v1(37.5,67) v1(37.5,66.25) v1(37.5,65.5) v1(41.5,65.3) v1(47.55,62.45) v1(50,64.6) v1(52.45,62.45)
$1N891: length 4.8
  Top Layer w0.15: 50.7,26.25 50.75,26.3 50.75,27.1 50.6,27.25 49,27.25 48.75,27.5 U1.6
$1N900: length 3
  Top Layer w0.15: 48.3,26.25 48.25,26.3 U1.5
$1N23358: length 18.6
  Bottom Layer w0.15: LED7.1 26.45,31.95 27.5,33 27.5,49.03 LED8.3
$1N23472: length 48.6
  Top Layer w0.15: v1(9.75,60.25) 9.75,58.75 13.25,55.25 15.25,55.25 v1(16.75,53.75)
  Bottom Layer w0.15: LED8.1 25.67,50.92 22,47.25 18.25,47.25 16.75,48.75 v1(16.75,53.75) ; v1(9.75,60.25) 9.72,60.28 9.72,66.28 8.75,67.25 1.75,67.25 0.7,66.2 LED9.3
$1N23593: length 15.1
  Bottom Layer w0.15: LED10.3 0.7,51.3 1.8,52.4 LED9.1
$1N23714: length 15.1
  Bottom Layer w0.15: 1.8,42.08 1.8,35.4 0.7,34.3 LED11.3
$1N23835: length 15.1
  Bottom Layer w0.15: LED12.3 0.7,17.8 1.8,18.9 LED11.1
$1N23956: length 39.5
  Bottom Layer w0.15: LED13.3 27.55,3.05 26,1.5 2.75,1.5 1.8,2.45 LED12.1
$1N24077: length 23.9
  Bottom Layer w0.15: LED14.3 47.55,9.25 46.9,9.9 45.6,9.9 43,12.5 27,12.5 26.45,11.95 LED13.1
$1N24198: length 23.9
  Bottom Layer w0.15: LED14.1 46.45,11.95 47,12.5 63,12.5 65.6,9.9 66.9,9.9 67.55,9.25 LED15.3
$1N24319: length 26.4
  Bottom Layer w0.15: LED15.1 66.45,11.7 66.75,12 68,12 68.5,11.5 68.5,10.5 72,7 87,7 87.55,7.55 LED16.3
$1N25050: length 19.4
  Top Layer w0.15: 8,41 9.75,42.75 R95.1 11.8,41.94 11.8,28.56 R96.2
$1N25096: length 19.2
  Top Layer w0.15: 8,24.5 9.75,26.25 R96.1 R97.2
$1N25136: length 3.7
  Top Layer w0.15: 8,7.5 9.75,9.25 R97.1
$1N25337: length 3
  Top Layer w0.3: 33.84,42.46 33.99,42.31 R99.2 R100.1
$1N25463: length 1.7
  Top Layer w0.3: R101.2 34.5,45.75 34.5,45.25 34.75,45 Q1.3
$2N1269: length 3.1
  Top Layer w0.15: R20.1 51.5,64 v1(51.5,63.75)
  Bottom Layer w0.15: v1(51.5,63.75) 51.75,63.5 USB1.B5
$2N1277: length 3.1
  Top Layer w0.15: v1(48.5,63.75) 48.5,64 R19.1
  Bottom Layer w0.15: v1(48.5,63.75) 48.75,63.5 USB1.A5
$2N1321: length 1.6
  Top Layer w0.15: C18.2 59.2,52.25 U14.5
$2N1373: length 5
  Top Layer w0.15: C18.1 58.25,52.7 58.25,54.5 58,54.75 57.5,54.75 57.3,54.95 U14.3
$2N3996: length 4.3
  Top Layer w0.2: U16.2 40.13,62.61 40.5,62.25 40.5,60.25 R18.2
$2N4003: length 9.1
  Top Layer w0.15: U16.7 32.63,62.61 32.25,63 29.07,63 v1(28,64.07)
  Bottom Layer w0.15: v1(28,64.07) 26.04,64.07 LED3.1
$2N4004: length 7.1
  Top Layer w0.15: v1(29,64) 29.12,63.89 U16.6
  Bottom Layer w0.15: v1(29,64) 28.15,64.85 LED4.1
$2N4883: length 3.3
  Top Layer w0.2: R77.2 37,60.75 37.59,61.34 U16.1
$2N4925: length 2.1
  Top Layer w0.2: U16.8 34,61.34 R78.1
$2N6641: length 1.5
  Bottom Layer w0.15: 23.75,63 23.75,61.51 23.75,61.5
$2N6678: length 1.5
  Bottom Layer w0.15: 26.75,63 26.75,61.51 26.75,61.5
$2N6681: length 1.5
  Bottom Layer w0.15: 25.25,61.5 25.25,61.51 25.25,63
$3N3875: length 8.8
  Top Layer w0.15: R34.1 R36.2 75.16,23.41 U24.5 78.25,23.43 v1(78.25,24.5)
  Bottom Layer w0.15: C54.2 78.25,23.95 v1(78.25,24.5)
$3N4010: length 8.8
  Top Layer w0.15: R33.1 R35.2 75.16,53.41 U22.5 78.25,53.43 v1(78.25,54.5)
  Bottom Layer w0.15: v1(78.25,54.5) 78.25,53.95 C53.2
$3N4202: length 8.1
  Top Layer w0.15: 79,46.75 79.94,46.75 80.3,47.11 C51.2 75.25,48 R29.2
$3N4208: length 7.4
  Top Layer w0.15: U22.6 77.13,52.14 75.75,50.75 74,50.75 R30.2 R29.1
$3N4263: length 5.8
  Top Layer w0.15: R31.2 75.25,18 C52.2
$3N4269: length 7.4
  Top Layer w0.15: U24.6 77.13,22.14 75.75,20.75 74,20.75 R32.2 R31.1
$3N4651: length 7.3
  Top Layer w0.15: R49.1 74.75,37 R50.2
  Top Layer w0.2: R50.2 73.25,39.25 75.37,41.36 U23.2
$3N4719: length 6.5
  Top Layer w0.2: U23.6 72.41,42.64 73.25,43.48 R48.2 73.25,45.5 R47.1
$3N4828: length 3.9
  Top Layer w0.15: v1(69.8,43) 69.8,43.55 70.16,43.91 U23.5
  Bottom Layer w0.15: R57.2 69.8,44.7 v1(69.8,43)
$3N4856: length 9.6
  Top Layer w0.15: v1(69.8,41) 70.05,40.75 73.25,40.75 75.13,42.64 U23.3
  Bottom Layer w0.15: v1(69.8,41) 69.8,39.3 R58.2
$3N6804: length 4.1
  Top Layer w0.15: R64.2 86.62,22.14 U24.3
$3N6808: length 4.1
  Top Layer w0.15: R52.2 86.62,52.14 U22.3
$3N7920: length 10.7
  Top Layer w0.15: U20.12 76.39,30.64 R54.2 74,28.25 72.75,28.25 72.5,28 72.5,25.25 R56.2
$3N7921: length 6.5
  Top Layer w0.15: U20.14 76.85,28.09 R59.1 73.25,27.5 R61.1
$3N7922: length 6.6
  Top Layer w0.15: R59.2 73.25,26 R56.1 77.08,26.83 U20.15
$3N8116: length 26.8
  Top Layer w0.15: 84.32,26.83 84.82,26.83 85.5,27.5 85.5,35 84.75,35.75 72.75,35.75 72.5,35.5 72.5,34.25 R60.1 R55.2
  Top Layer w0.2: U20.2 84.32,26.83
$3N8118: length 10.7
  Top Layer w0.15: 74.75,31.25 80.75,31.25 81.37,30.64 U20.5 ; 74.75,31.25 R55.1 ; 74.75,31.25 R53.1
$3N8119: length 33.3
  Top Layer w0.15: R54.1 R53.2 72,31.75 72,35.75 72.5,36.25 85,36.25 86,35.25 86,26.5 85.06,25.56 U20.1
$3N8120: length 18.5
  Top Layer w0.15: R60.2 R62.2 75,35.25 84.5,35.25 85,34.75 85,29.75 84.62,29.36 U20.4
$3N8594: length 10.7
  Top Layer w0.15: R40.2 72.5,55.25 72.5,58 72.75,58.25 74,58.25 R38.2 76.39,60.64 U19.12
$3N8595: length 6.5
  Top Layer w0.15: R45.1 73.25,57.5 R41.1 76.85,58.09 U19.14
$3N8598: length 6.6
  Top Layer w0.15: R41.2 73.25,56 R40.1 77.08,56.83 U19.15
$3N8602: length 26.8
  Top Layer w0.15: 84.32,56.83 84.82,56.83 85.5,57.5 85.5,65 84.75,65.75 72.75,65.75 72.5,65.5 72.5,64.25 R44.1 R39.2
  Top Layer w0.2: U19.2 84.32,56.83
$3N8603: length 10.7
  Top Layer w0.15: 74.75,61.25 R39.1 ; 74.75,61.25 R37.1 ; 74.75,61.25 80.75,61.25 81.37,60.64 U19.5
$3N8605: length 33.3
  Top Layer w0.15: R38.1 R37.2 72,61.75 72,65.75 72.5,66.25 85,66.25 86,65.25 86,56.5 85.06,55.56 U19.1
$3N8619: length 18.5
  Top Layer w0.15: R44.2 R46.2 75,65.25 84.5,65.25 85,64.75 85,59.75 84.62,59.36 U19.4
$3N8929: length 13.4
  Top Layer w0.15: R24.2 91.34,42.75 C45.2
  Top Layer w0.2: 92.5,43.41 92.59,43.5 95.5,43.5 97.27,45.27 U17.3
$3N10125: length 2
  Top Layer w0.2: U17.4 94.63,48.5 R23.2
$3N10859: length 13.4
  Top Layer w0.15: C46.2 91.34,12.75 R26.2
  Top Layer w0.2: 92.5,13.41 92.59,13.5 95.5,13.5 97.27,15.27 U18.3
$3N10862: length 2
  Top Layer w0.2: U18.4 94.63,18.5 R25.2
$3N10903: length 1.5
  Top Layer w0.2: 93.25,41.5 94.63,41.5 U17.1
$3N10977: length 1.5
  Top Layer w0.2: U18.1 94.63,11.5 93.25,11.5
$4N3306: length 1.5
  Bottom Layer w0.15: 22.25,63 22.25,61.51 22.25,61.5

## Copper pours and planes (outline as drawn; the poured copper is in the pictures)
GND on Bottom Layer: 54.06,17.5 54.06,0 90,0 90,9.75 88.25,11.5 83.75,11.5 82.85,12.4 82.85,16.67 82.02,17.5
GND on Bottom Layer: 0,70 0,0 54.75,0 54.75,70
GND on Inner1: 0.26,69.74 89.87,69.74 89.87,0.26 0.26,0.26
GNDA on Bottom Layer: 54.75,69.75 100,69.75 100,0 54.75,0
GNDA on Inner1: 47.13,69.74 99.74,69.74 99.74,0.26 47.13,0.26
VBAT on Top Layer: 30.5,65.75 30.5,64.75 35,64.75 35.75,65.5 35.75,67.75 34.25,67.75 34.25,66.25 33.75,65.75
VBAT on 内层2: 11.88,68.12 36.12,68.12 36.12,63.63 11.88,63.63
VCC on Top Layer: 46.5,56.5 46.5,48 43.25,48 43,48.25 43,56.25 43.25,56.5
VCC on 内层2: 0.26,69.74 86.82,69.74 86.82,0.26 0.26,0.26
VDD on Top Layer: 49.25,47.5 54.25,47.5 54.5,47.75 54.5,49.52 52.98,49.52 51.75,50.75 49.25,50.75
VDD on Bottom Layer: 54.25,58.5 54.25,46 54,45.75 49,45.75 48.75,46 48.75,47 51.25,49.5 51.25,58.5 51.5,58.75 54,58.75
VDD on 内层2: 9.89,69.74 99.74,69.74 99.74,0.26 9.89,0.26
VDD on 内层2: 8.94,69.74 30.12,69.74 30.12,66.88 8.94,66.88
VDDA on Top Layer: 54.21,57 49.25,57 49.25,53.75 51.75,53.75 53,55 54.5,55 54.5,56.71
VDDA on 内层2: 51.25,59.87 80.87,59.87 80.87,17.73 51.25,17.73
VEEA on 内层2: 58.88,63.87 84.62,63.87 84.62,17.73 58.88,17.73
VREF+ on 内层2: 58.22,53.53 73.87,53.53 73.87,22.47 58.22,22.47
VUSB on Top Layer: 42,65.75 42,64.75 37.5,64.75 36.75,65.5 36.75,67.75 38.25,67.75 38.25,66.25 38.75,65.75
VUSB on 内层2: 11.88,69.74 58.62,69.74 58.62,59.63 11.88,59.63

Small or netless copper shapes (teardrops, artwork), in the pictures only: 118 on Inner1, 16 on 内层2
